# Altium schematic sheet DUT.SchDoc
size A1; SPICEModelCacheEPBFKGZM: <root> / <DocumentId>EPBFKGZM</DocumentId> / </root>
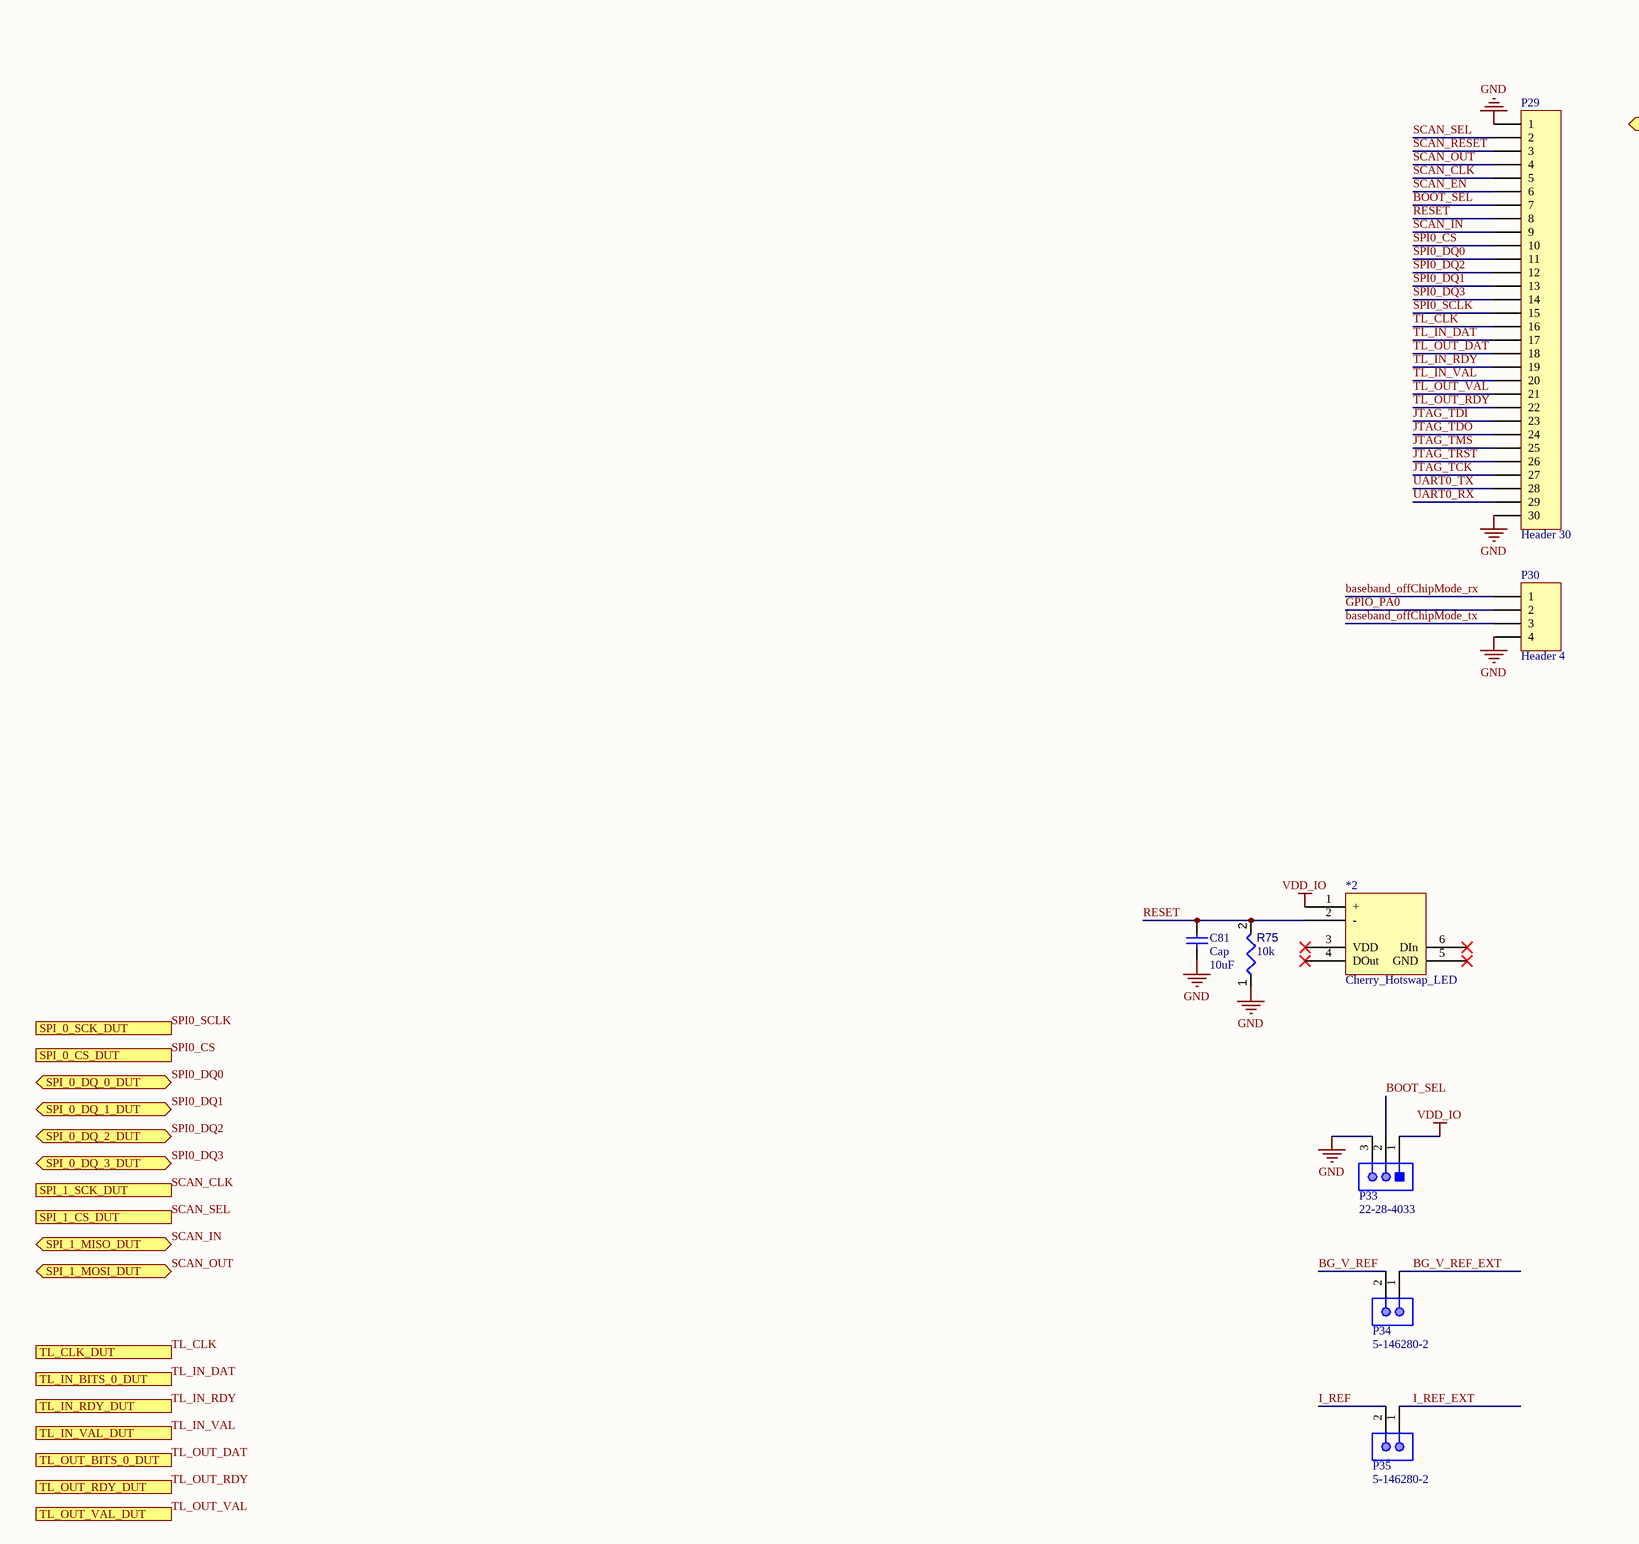
[diagram p0: DUT.SchDoc, top left]
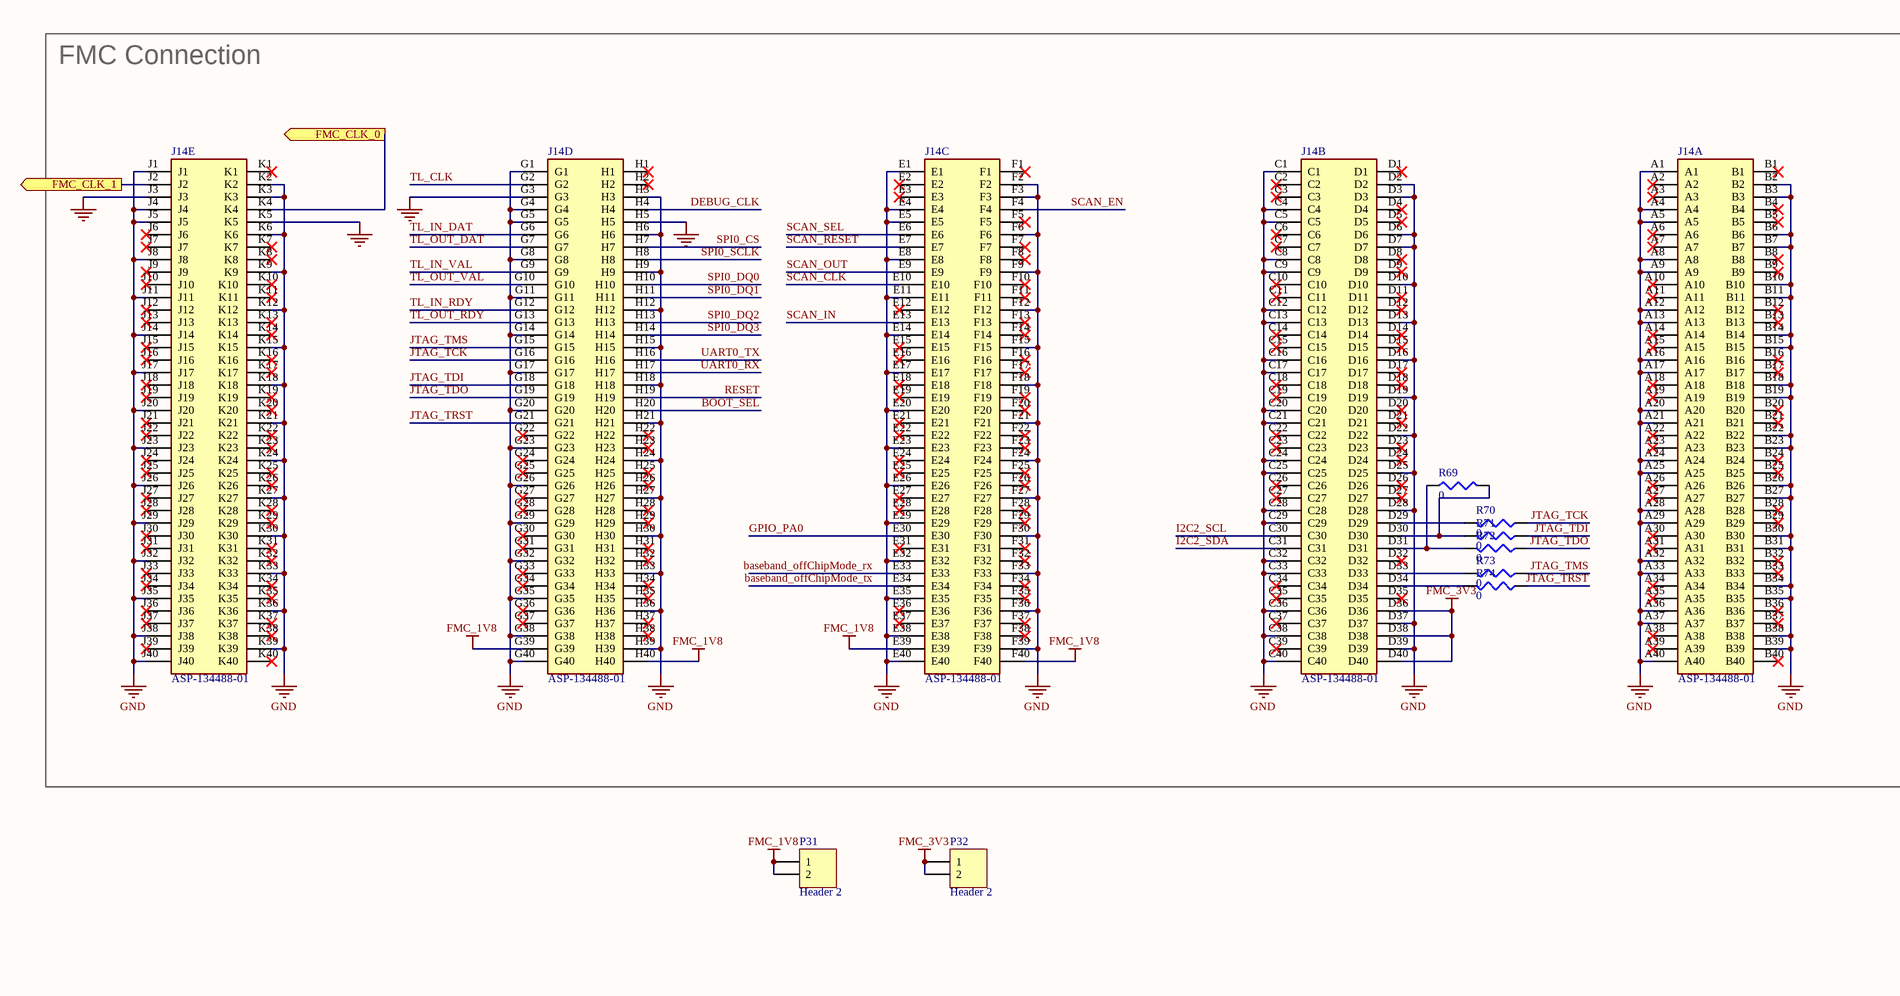
[diagram p1: DUT.SchDoc, top right]
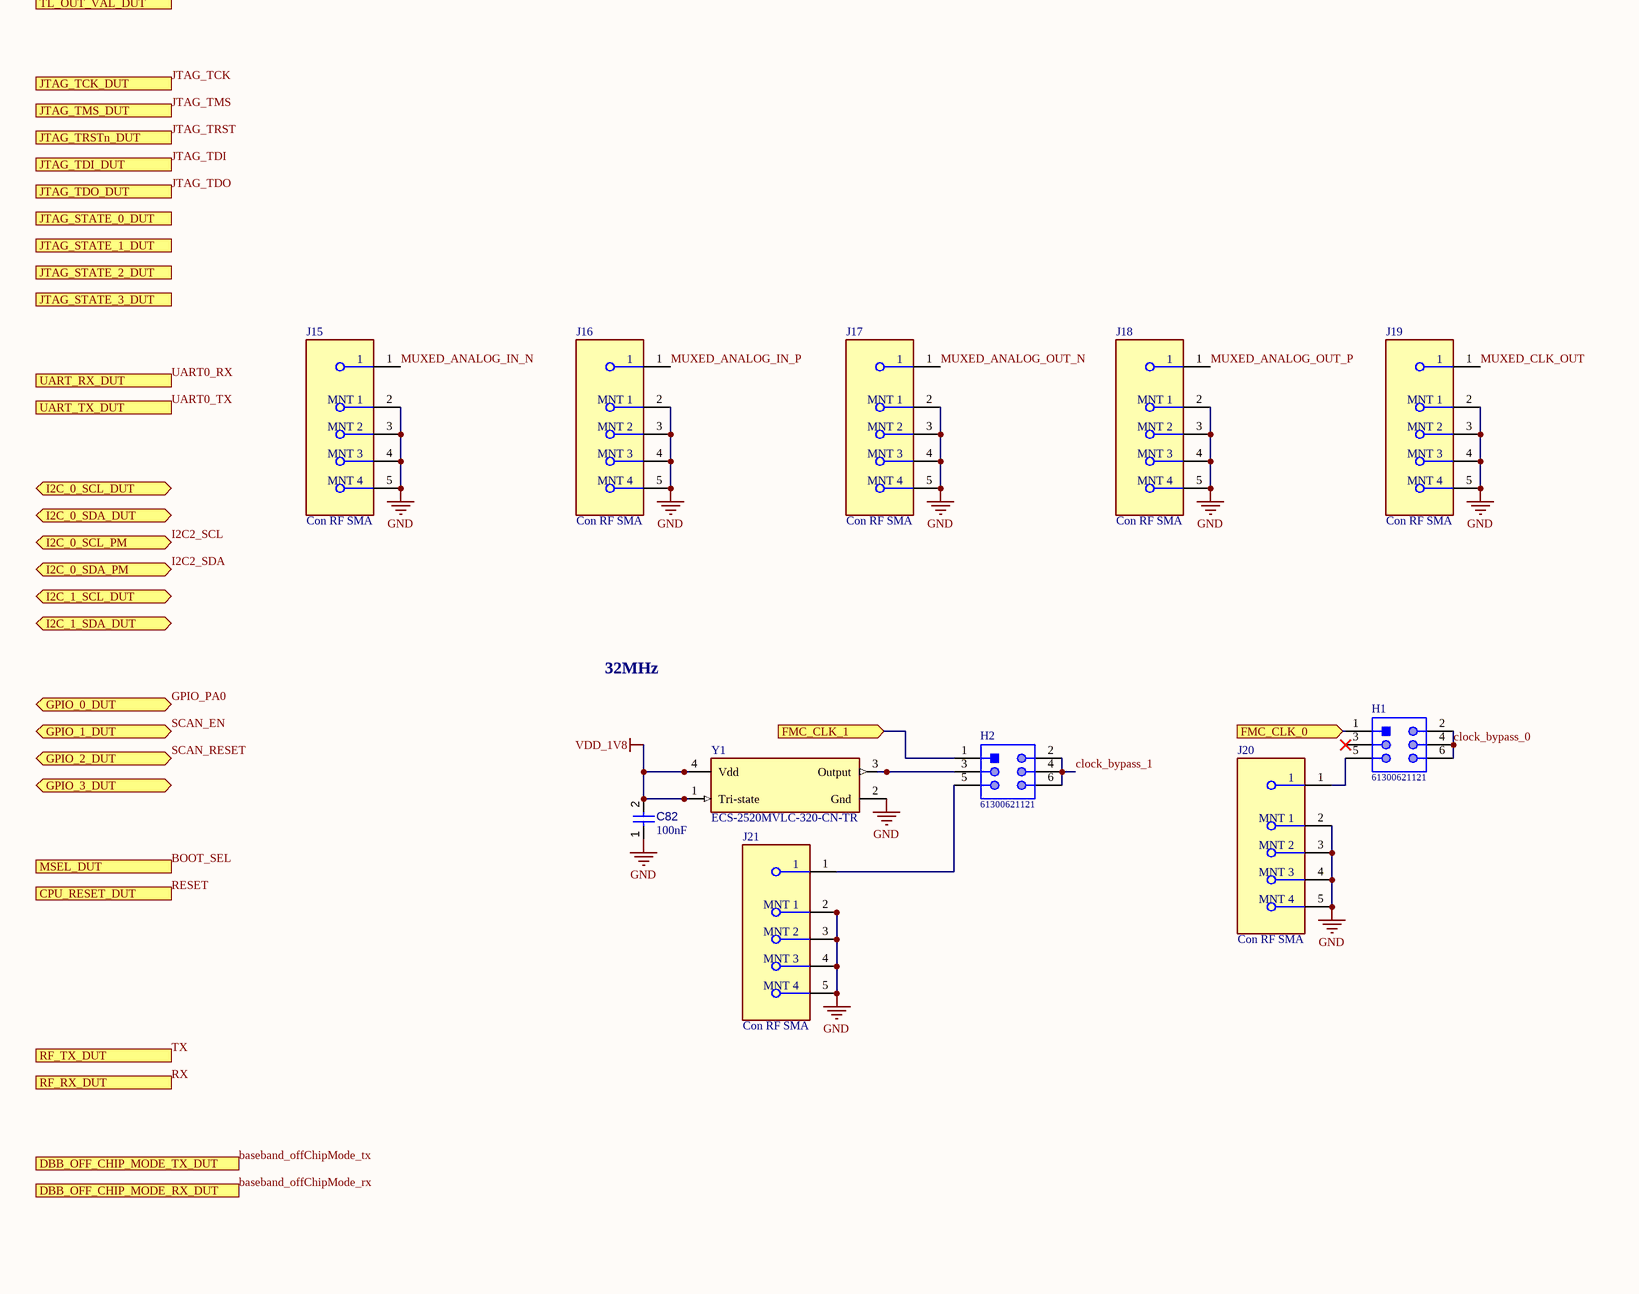
[diagram p2: DUT.SchDoc, bottom left]
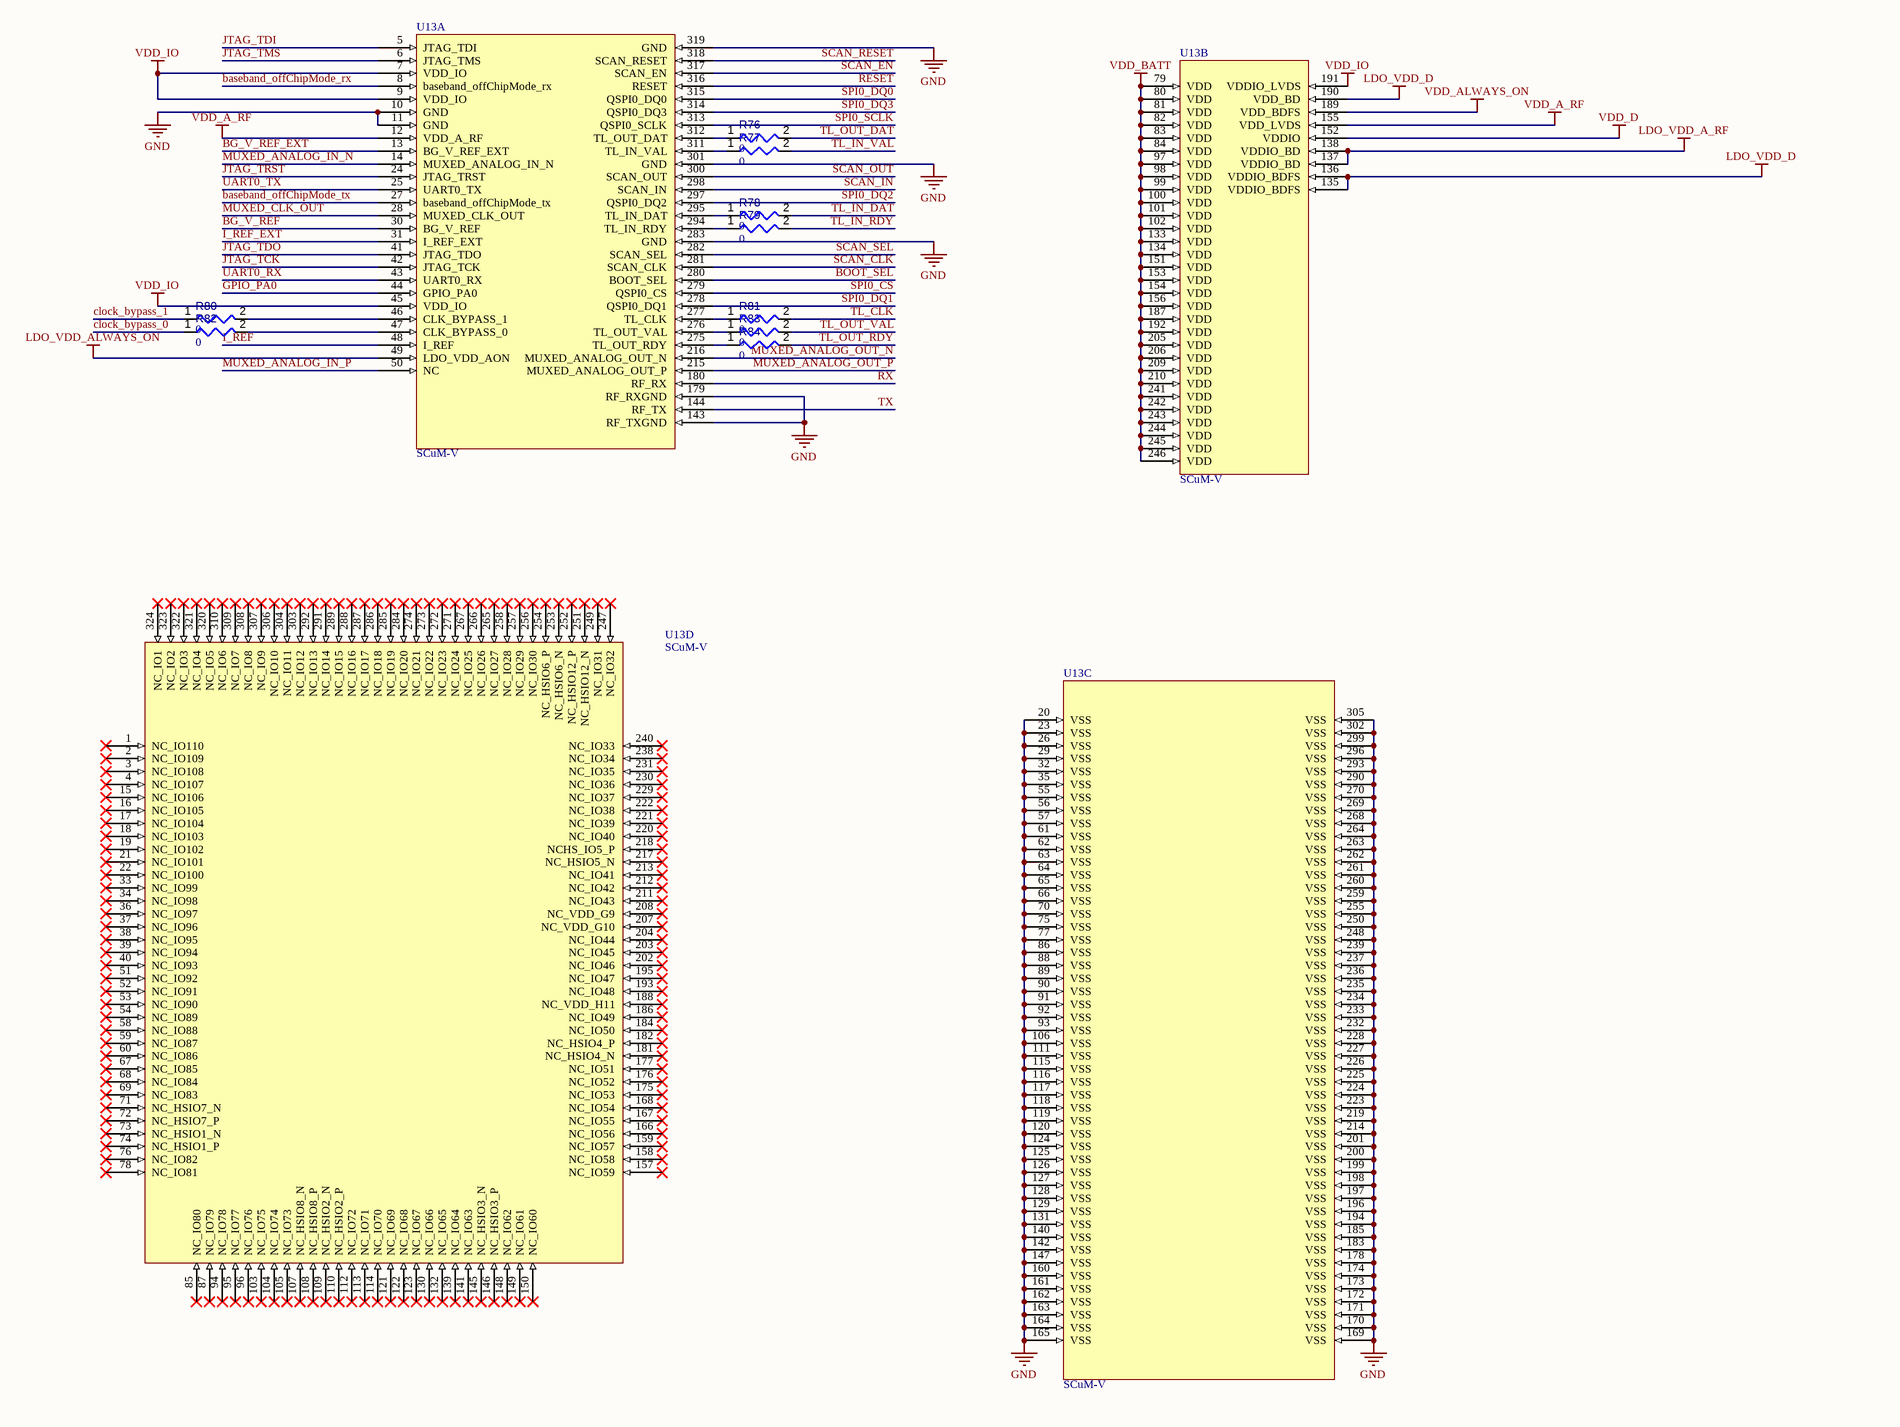
[diagram p3: DUT.SchDoc, bottom right]

## Parts
*2  Cherry_Hotswap_LED  [New footprint 1]
C81  Cap  value 10uF  [0805]
C82  value 100nF  [CAPC1608X90X40NL10T20]  (hidden comment: Capacitor 100 nF +/-10% 50 V 0603)
H1  61300621121  [61300621121]
H2  61300621121  [61300621121]
J14  ASP-134488-01  [SAMTEC_ASP-134488-01]  (parts A,B,C,D,E of 5)
J15  Con RF SMA  [FP-RF2-04A-T-00-50-G-MFG]
J16  Con RF SMA  [FP-RF2-04A-T-00-50-G-MFG]
J17  Con RF SMA  [FP-RF2-04A-T-00-50-G-MFG]
J18  Con RF SMA  [FP-RF2-04A-T-00-50-G-MFG]
J19  Con RF SMA  [FP-RF2-04A-T-00-50-G-MFG]
J20  Con RF SMA  [FP-RF2-04A-T-00-50-G-MFG]
J21  Con RF SMA  [FP-RF2-04A-T-00-50-G-MFG]
P29  Header 30  [HDR1X30]
P30  Header 4  [HDR1X4]
P31  Header 2  [HDR1X2]
P32  Header 2  [HDR1X2]
P33  22-28-4033  [MOLX-22-28-4033_V]
P34  5-146280-2  [TECO-5-146280-2_V]
P35  5-146280-2  [TECO-5-146280-2_V]
R69  0  [0603]
R70  0  [0603]
R71  0  [0603]
R72  0  [0603]
R73  0  [0603]
R74  0  [0603]
R75  value 10k  [RESC1608X55X25ML10T15]  (hidden comment: Resistor 10k +/-1% 0603 100 mW)
R76  value 0  [RESC0402(1005)_L]  (hidden comment: 0R2J)
R77  value 0  [RESC0402(1005)_L]  (hidden comment: 0R2J)
R78  value 0  [RESC0402(1005)_L]  (hidden comment: 0R2J)
R79  value 0  [RESC0402(1005)_L]  (hidden comment: 0R2J)
R80  value 0  [RESC0402(1005)_L]  (hidden comment: 0R2J)
R81  value 0  [RESC0402(1005)_L]  (hidden comment: 0R2J)
R82  value 0  [RESC0402(1005)_L]  (hidden comment: 0R2J)
R83  value 0  [RESC0402(1005)_L]  (hidden comment: 0R2J)
R84  value 0  [RESC0402(1005)_L]  (hidden comment: 0R2J)
U13  SCuM-V  [BGA324x18]  (parts A,B,C,D of 4)
Y1  ECS-2520MVLC-320-CN-TR  [FP-ECS-2520MVLC-MFG]

## Blocks framed on the sheet
FMC Connection: J14 R69-R74

## Ports
CPU_RESET_DUT (in), DBB_OFF_CHIP_MODE_RX_DUT (out), DBB_OFF_CHIP_MODE_TX_DUT (out), FMC_CLK_0 (in), FMC_CLK_0 (out), FMC_CLK_1 (in), FMC_CLK_1 (out), GPIO_0_DUT (bidir), GPIO_1_DUT (bidir), GPIO_2_DUT (bidir), GPIO_3_DUT (bidir), I2C_0_SCL_DUT (bidir), I2C_0_SCL_PM (bidir), I2C_0_SDA_DUT (bidir), I2C_0_SDA_PM (bidir), I2C_1_SCL_DUT (bidir), I2C_1_SDA_DUT (bidir), JTAG_STATE_0_DUT (out), JTAG_STATE_1_DUT (out), JTAG_STATE_2_DUT (out), JTAG_STATE_3_DUT (out), JTAG_TCK_DUT (in), JTAG_TDI_DUT (in), JTAG_TDO_DUT (out), JTAG_TMS_DUT (in), JTAG_TRSTn_DUT (in), MSEL_DUT (out), RF_RX_DUT (in), RF_TX_DUT (out), SPI_0_CS_DUT (out), SPI_0_DQ_0_DUT (bidir), SPI_0_DQ_1_DUT (bidir), SPI_0_DQ_2_DUT (bidir), SPI_0_DQ_3_DUT (bidir), SPI_0_SCK_DUT (out), SPI_1_CS_DUT (out), SPI_1_MISO_DUT (bidir), SPI_1_MOSI_DUT (bidir), SPI_1_SCK_DUT (out), TL_CLK_DUT (out), TL_IN_BITS_0_DUT (in), TL_IN_RDY_DUT (out), TL_IN_VAL_DUT (in), TL_OUT_BITS_0_DUT (out), TL_OUT_RDY_DUT (in), TL_OUT_VAL_DUT (out), UART_RX_DUT (in), UART_TX_DUT (out)

## Nets
FMC_1V8: J14.E39 J14.F40 J14.G39 J14.H40 P31.1 P31.2
FMC_3V3: J14.D36 J14.D38 J14.D40 P32.1 P32.2
GND: C81.1 C82.1 J14.A1 J14.A4 J14.A5 J14.A8 J14.A9 J14.A12 J14.A13 J14.A16 J14.A17 J14.A20 J14.A21 J14.A24 J14.A25 J14.A28 J14.A29 J14.A32 J14.A33 J14.A36 J14.A37 J14.A40 J14.B2 J14.B3 J14.B6 J14.B7 J14.B10 J14.B11 J14.B14 J14.B15 J14.B18 J14.B19 J14.B22 J14.B23 J14.B26 J14.B27 J14.B30 J14.B31 J14.B34 J14.B35 J14.B38 J14.B39 J14.C1 J14.C4 J14.C5 J14.C8 J14.C9 J14.C12 J14.C13 J14.C16 J14.C17 J14.C20 J14.C21 J14.C24 J14.C25 J14.C28 J14.C29 J14.C32 J14.C33 J14.C36 J14.C38 J14.C40 J14.D2 J14.D3 J14.D6 J14.D7 J14.D10 J14.D13 J14.D16 J14.D19 J14.D22 J14.D25 J14.D28 J14.D37 J14.D39 J14.E1 J14.E4 J14.E5 J14.E8 J14.E11 J14.E14 J14.E17 J14.E20 J14.E23 J14.E26 J14.E29 J14.E32 J14.E35 J14.E38 J14.E40 J14.F2 J14.F3 J14.F6 J14.F9 J14.F12 J14.F15 J14.F18 J14.F21 J14.F24 J14.F27 J14.F30 J14.F33 J14.F36 J14.F39 J14.G1 J14.G3 J14.G4 J14.G5 J14.G8 J14.G11 J14.G14 J14.G17 J14.G20 J14.G23 J14.G26 J14.G29 J14.G32 J14.G35 J14.G38 J14.G40 J14.H3 J14.H5 J14.H6 J14.H9 J14.H12 J14.H15 J14.H18 J14.H21 J14.H24 J14.H27 J14.H30 J14.H33 J14.H36 J14.H39 J14.J1 J14.J3 J14.J4 J14.J5 J14.J8 J14.J11 J14.J14 J14.J17 J14.J20 J14.J23 J14.J26 J14.J29 J14.J32 J14.J35 J14.J38 J14.J40 J14.K2 J14.K3 J14.K5 J14.K6 J14.K9 J14.K12 J14.K15 J14.K18 J14.K21 J14.K24 J14.K27 J14.K30 J14.K33 J14.K36 J14.K39 J15.2(MNT_1) J15.3(MNT_2) J15.4(MNT_3) J15.5(MNT_4) J16.2(MNT_1) J16.3(MNT_2) J16.4(MNT_3) J16.5(MNT_4) J17.2(MNT_1) J17.3(MNT_2) J17.4(MNT_3) J17.5(MNT_4) J18.2(MNT_1) J18.3(MNT_2) J18.4(MNT_3) J18.5(MNT_4) J19.2(MNT_1) J19.3(MNT_2) J19.4(MNT_3) J19.5(MNT_4) J20.2(MNT_1) J20.3(MNT_2) J20.4(MNT_3) J20.5(MNT_4) J21.2(MNT_1) J21.3(MNT_2) J21.4(MNT_3) J21.5(MNT_4) P29.1 P29.30 P30.4 P33.3 R75.1 U13.10(GND) U13.11(GND) U13.20(VSS) U13.23(VSS) U13.26(VSS) U13.29(VSS) U13.32(VSS) U13.35(VSS) U13.55(VSS) U13.56(VSS) U13.57(VSS) U13.61(VSS) U13.62(VSS) U13.63(VSS) U13.64(VSS) U13.65(VSS) U13.66(VSS) U13.70(VSS) U13.75(VSS) U13.77(VSS) U13.86(VSS) U13.88(VSS) U13.89(VSS) U13.90(VSS) U13.91(VSS) U13.92(VSS) U13.93(VSS) U13.106(VSS) U13.111(VSS) U13.115(VSS) U13.116(VSS) U13.117(VSS) U13.118(VSS) U13.119(VSS) U13.120(VSS) U13.124(VSS) U13.125(VSS) U13.126(VSS) U13.127(VSS) U13.128(VSS) U13.129(VSS) U13.131(VSS) U13.140(VSS) U13.142(VSS) U13.143(RF_TXGND) U13.147(VSS) U13.160(VSS) U13.161(VSS) U13.162(VSS) U13.163(VSS) U13.164(VSS) U13.165(VSS) U13.169(VSS) U13.170(VSS) U13.171(VSS) U13.172(VSS) U13.173(VSS) U13.174(VSS) U13.178(VSS) U13.179(RF_RXGND) U13.183(VSS) U13.185(VSS) U13.194(VSS) U13.196(VSS) U13.197(VSS) U13.198(VSS) U13.199(VSS) U13.200(VSS) U13.201(VSS) U13.214(VSS) U13.219(VSS) U13.223(VSS) U13.224(VSS) U13.225(VSS) U13.226(VSS) U13.227(VSS) U13.228(VSS) U13.232(VSS) U13.233(VSS) U13.234(VSS) U13.235(VSS) U13.236(VSS) U13.237(VSS) U13.239(VSS) U13.248(VSS) U13.250(VSS) U13.255(VSS) U13.259(VSS) U13.260(VSS) U13.261(VSS) U13.262(VSS) U13.263(VSS) U13.264(VSS) U13.268(VSS) U13.269(VSS) U13.270(VSS) U13.283(GND) U13.290(VSS) U13.293(VSS) U13.296(VSS) U13.299(VSS) U13.301(GND) U13.302(VSS) U13.305(VSS) U13.319(GND) Y1.2(Gnd)
LDO_VDD_A_RF: U13.137(VDDIO_BD) U13.138(VDDIO_BD)
LDO_VDD_ALWAYS_ON: U13.49(LDO_VDD_AON)
LDO_VDD_D: U13.135(VDDIO_BDFS) U13.136(VDDIO_BDFS) U13.190(VDD_BD)
VDD_1V8: C82.2 Y1.1(Tri-state) Y1.4(Vdd)
VDD_A_RF: U13.12(VDD_A_RF) U13.155(VDD_LVDS)
VDD_ALWAYS_ON: U13.189(VDD_BDFS)
VDD_BATT: U13.79(VDD) U13.80(VDD) U13.81(VDD) U13.82(VDD) U13.83(VDD) U13.84(VDD) U13.97(VDD) U13.98(VDD) U13.99(VDD) U13.100(VDD) U13.101(VDD) U13.102(VDD) U13.133(VDD) U13.134(VDD) U13.151(VDD) U13.153(VDD) U13.154(VDD) U13.156(VDD) U13.187(VDD) U13.192(VDD) U13.205(VDD) U13.206(VDD) U13.209(VDD) U13.210(VDD) U13.241(VDD) U13.242(VDD) U13.243(VDD) U13.244(VDD) U13.245(VDD) U13.246(VDD)
VDD_D: U13.152(VDDIO)
VDD_IO: *2.1(+) P33.1 U13.7(VDD_IO) U13.9(VDD_IO) U13.45(VDD_IO) U13.191(VDDIO_LVDS)
baseband_offChipMode_rx: J14.E33 P30.1 U13.8(baseband_offChipMode_rx) ; port DBB_OFF_CHIP_MODE_RX_DUT
baseband_offChipMode_tx: J14.E34 P30.3 U13.27(baseband_offChipMode_tx) ; port DBB_OFF_CHIP_MODE_TX_DUT
BG_V_REF: P34.2 U13.30(BG_V_REF)
BG_V_REF_EXT: P34.1 U13.13(BG_V_REF_EXT)
BOOT_SEL: J14.H20 P29.7 P33.2 U13.280(BOOT_SEL) ; port MSEL_DUT
clock_bypass_0: H1.2 H1.4 H1.6 R82.1
clock_bypass_1: H2.2 H2.4 H2.6 R80.1
DEBUG_CLK: J14.H4
FMC_CLK_0: H1.1 J14.K4 ; port FMC_CLK_0
FMC_CLK_1: H2.1 J14.J2 ; port FMC_CLK_1
GPIO_PA0: J14.E30 P30.2 U13.44(GPIO_PA0) ; port GPIO_0_DUT
I2C2_SCL: J14.C30 ; port I2C_0_SCL_PM
I2C2_SDA: J14.C31 ; port I2C_0_SDA_PM
I_REF: P35.2 U13.48(I_REF)
I_REF_EXT: P35.1 U13.31(I_REF_EXT)
JTAG_TCK: J14.G16 P29.27 R70.2 U13.42(JTAG_TCK) ; port JTAG_TCK_DUT
JTAG_TDI: J14.G18 P29.23 R71.2 U13.5(JTAG_TDI) ; port JTAG_TDI_DUT
JTAG_TDO: J14.G19 P29.24 R72.2 U13.41(JTAG_TDO) ; port JTAG_TDO_DUT
JTAG_TMS: J14.G15 P29.25 R73.2 U13.6(JTAG_TMS) ; port JTAG_TMS_DUT
JTAG_TRST: J14.G21 P29.26 R74.2 U13.24(JTAG_TRST) ; port JTAG_TRSTn_DUT
MUXED_ANALOG_IN_N: J15.1 U13.14(MUXED_ANALOG_IN_N)
MUXED_ANALOG_IN_P: J16.1 U13.50(NC)
MUXED_ANALOG_OUT_N: J17.1 U13.216(MUXED_ANALOG_OUT_N)
MUXED_ANALOG_OUT_P: J18.1 U13.215(MUXED_ANALOG_OUT_P)
MUXED_CLK_OUT: J19.1 U13.28(MUXED_CLK_OUT)
RESET: *2.2(-) C81.2 J14.H19 P29.8 R75.2 U13.316(RESET) ; port CPU_RESET_DUT
RX: U13.180(RF_RX) ; port RF_RX_DUT
SCAN_CLK: J14.E10 P29.5 U13.281(SCAN_CLK) ; port SPI_1_SCK_DUT
SCAN_EN: J14.F4 P29.6 U13.317(SCAN_EN) ; port GPIO_1_DUT
SCAN_IN: J14.E13 P29.9 U13.298(SCAN_IN) ; port SPI_1_MISO_DUT
SCAN_OUT: J14.E9 P29.4 U13.300(SCAN_OUT) ; port SPI_1_MOSI_DUT
SCAN_RESET: J14.E7 P29.3 U13.318(SCAN_RESET) ; port GPIO_2_DUT
SCAN_SEL: J14.E6 P29.2 U13.282(SCAN_SEL) ; port SPI_1_CS_DUT
SPI0_CS: J14.H7 P29.10 U13.279(QSPI0_CS) ; port SPI_0_CS_DUT
SPI0_DQ0: J14.H10 P29.11 U13.315(QSPI0_DQ0) ; port SPI_0_DQ_0_DUT
SPI0_DQ1: J14.H11 P29.13 U13.278(QSPI0_DQ1) ; port SPI_0_DQ_1_DUT
SPI0_DQ2: J14.H13 P29.12 U13.297(QSPI0_DQ2) ; port SPI_0_DQ_2_DUT
SPI0_DQ3: J14.H14 P29.14 U13.314(QSPI0_DQ3) ; port SPI_0_DQ_3_DUT
SPI0_SCLK: J14.H8 P29.15 U13.313(QSPI0_SCLK) ; port SPI_0_SCK_DUT
TL_CLK: J14.G2 P29.16 R81.2 ; port TL_CLK_DUT
TL_IN_DAT: J14.G6 P29.17 R78.2 ; port TL_IN_BITS_0_DUT
TL_IN_RDY: J14.G12 P29.19 R79.2 ; port TL_IN_RDY_DUT
TL_IN_VAL: J14.G9 P29.20 R77.2 ; port TL_IN_VAL_DUT
TL_OUT_DAT: J14.G7 P29.18 R76.2 ; port TL_OUT_BITS_0_DUT
TL_OUT_RDY: J14.G13 P29.22 R84.2 ; port TL_OUT_RDY_DUT
TL_OUT_VAL: J14.G10 P29.21 R83.2 ; port TL_OUT_VAL_DUT
TX: U13.144(RF_TX) ; port RF_TX_DUT
UART0_RX: J14.H17 P29.29 U13.43(UART0_RX) ; port UART_RX_DUT
UART0_TX: J14.H16 P29.28 U13.25(UART0_TX) ; port UART_TX_DUT
NetH1_5: H1.5 J20.1
NetH2_3: H2.3 Y1.3(Output)
NetH2_5: H2.5 J21.1
NetJ14_D29: J14.D29 R70.1
NetJ14_D30: J14.D30 R69.1 R71.1
NetJ14_D31: J14.D31 R69.2 R72.1
NetJ14_D33: J14.D33 R73.1
NetJ14_D34: J14.D34 R74.1
NetR76_1: R76.1 U13.312(TL_OUT_DAT)
NetR77_1: R77.1 U13.311(TL_IN_VAL)
NetR78_1: R78.1 U13.295(TL_IN_DAT)
NetR79_1: R79.1 U13.294(TL_IN_RDY)
NetR80_2: R80.2 U13.46(CLK_BYPASS_1)
NetR81_1: R81.1 U13.277(TL_CLK)
NetR82_2: R82.2 U13.47(CLK_BYPASS_0)
NetR83_1: R83.1 U13.276(TL_OUT_VAL)
NetR84_1: R84.1 U13.275(TL_OUT_RDY)

Not connected (* = marked no-connect by the designer): *2 3(VDD)* 4(DOut)* 5(GND)* 6(DIn)*; H1 3*; J14 A2* A3* A6* A7* A10* A11* A14* A15* A18* A19* A22* A23* A26* A27* A30* A31* A34* A35* A38* A39* B1* B4* B5* B8* B9* B12* B13* B16* B17* B20* B21* B24* B25* B28* B29* B32* B33* B36* B37* B40* C2* C3* C6* C7* C10* C11* C14* C15* C18* C19* C22* C23* C26* C27* C34* C35* C37* C39* D1* D4* D5* D8* D9* D11* D12* D14* D15* D17* D18* D20* D21* D23* D24* D26* D27* D32* D35* E2* E3* E12* E15* E16* E18* E19* E21* E22* E24* E25* E27* E28* E31* E36* E37* F1* F5* F7* F8* F10* F11* F13* F14* F16* F17* F19* F20* F22* F23* F25* F26* F28* F29* F31* F32* F34* F35* F37* F38* G22* G24* G25* G27* G28* G30* G31* G33* G34* G36* G37* H1* H2* H22* H23* H25* H26* H28* H29* H31* H32* H34* H35* H37* H38* J6* J7* J9* J10* J12* J13* J15* J16* J18* J19* J21* J22* J24* J25* J27* J28* J30* J31* J33* J34* J36* J37* J39* K1* K7* K8* K10* K11* K13* K14* K16* K17* K19* K20* K22* K23* K25* K26* K28* K29* K31* K32* K34* K35* K37* K38* K40*; U13 1(NC_IO110)* 2(NC_IO109)* 3(NC_IO108)* 4(NC_IO107)* 15(NC_IO106)* 16(NC_IO105)* 17(NC_IO104)* 18(NC_IO103)* 19(NC_IO102)* 21(NC_IO101)* 22(NC_IO100)* 33(NC_IO99)* 34(NC_IO98)* 36(NC_IO97)* 37(NC_IO96)* 38(NC_IO95)* 39(NC_IO94)* 40(NC_IO93)* 51(NC_IO92)* 52(NC_IO91)* 53(NC_IO90)* 54(NC_IO89)* 58(NC_IO88)* 59(NC_IO87)* 60(NC_IO86)* 67(NC_IO85)* 68(NC_IO84)* 69(NC_IO83)* 71(NC_HSIO7_N)* 72(NC_HSIO7_P)* 73(NC_HSIO1_N)* 74(NC_HSIO1_P)* 76(NC_IO82)* 78(NC_IO81)* 85(NC_IO80)* 87(NC_IO79)* 94(NC_IO78)* 95(NC_IO77)* 96(NC_IO76)* 103(NC_IO75)* 104(NC_IO74)* 105(NC_IO73)* 107(NC_HSIO8_N)* 108(NC_HSIO8_P)* 109(NC_HSIO2_N)* 110(NC_HSIO2_P)* 112(NC_IO72)* 113(NC_IO71)* 114(NC_IO70)* 121(NC_IO69)* 122(NC_IO68)* 123(NC_IO67)* 130(NC_IO66)* 132(NC_IO65)* 139(NC_IO64)* 141(NC_IO63)* 145(NC_HSIO3_N)* 146(NC_HSIO3_P)* 148(NC_IO62)* 149(NC_IO61)* 150(NC_IO60)* 157(NC_IO59)* 158(NC_IO58)* 159(NC_IO57)* 166(NC_IO56)* 167(NC_IO55)* 168(NC_IO54)* 175(NC_IO53)* 176(NC_IO52)* 177(NC_IO51)* 181(NC_HSIO4_N)* 182(NC_HSIO4_P)* 184(NC_IO50)* 186(NC_IO49)* 188(NC_VDD_H11)* 193(NC_IO48)* 195(NC_IO47)* 202(NC_IO46)* 203(NC_IO45)* 204(NC_IO44)* 207(NC_VDD_G10)* 208(NC_VDD_G9)* 211(NC_IO43)* 212(NC_IO42)* 213(NC_IO41)* 217(NC_HSIO5_N)* 218(NCHS_IO5_P)* 220(NC_IO40)* 221(NC_IO39)* 222(NC_IO38)* 229(NC_IO37)* 230(NC_IO36)* 231(NC_IO35)* 238(NC_IO34)* 240(NC_IO33)* 247(NC_IO32)* 249(NC_IO31)* 251(NC_HSIO12_N)* 252(NC_HSIO12_P)* 253(NC_HSIO6_N)* 254(NC_HSIO6_P)* 256(NC_IO30)* 257(NC_IO29)* 258(NC_IO28)* 265(NC_IO27)* 266(NC_IO26)* 267(NC_IO25)* 271(NC_IO24)* 272(NC_IO23)* 273(NC_IO22)* 274(NC_IO21)* 284(NC_IO20)* 285(NC_IO19)* 286(NC_IO18)* 287(NC_IO17)* 288(NC_IO16)* 289(NC_IO15)* 291(NC_IO14)* 292(NC_IO13)* 303(NC_IO12)* 304(NC_IO11)* 306(NC_IO10)* 307(NC_IO9)* 308(NC_IO8)* 309(NC_IO7)* 310(NC_IO6)* 320(NC_IO5)* 321(NC_IO4)* 322(NC_IO3)* 323(NC_IO2)* 324(NC_IO1)*

## Notes on the sheet
- 32MHz

## Library data of the parts
*2 = CMP-00028-00007-1
C81 = Cap: Capacitor; Published: 8-Jun-2000; LatestRevisionDate: 17-Jul-2002; LatestRevisionNote: Re-released for DXP Platform.; PackageReference: RAD-0.3; Publisher: Altium Limited; PackageDescription: Radial Cap, Thru-Hole; 2 Leads; 0.3 in Pin Spacing
C82 = CMP-001-00017-6: Chip Capacitor, 100 nF, +/- 10%, 50 V, 0603 (1608 Metric); Voltage Rating: 50V; Capacitor Type: Ceramic; Tolerance: 10%; Mounting Technology: SM; Max Operating Temperature: 125°C; RoHS Compliant: True; Pins: 2; Case/Package: 0603; Min Operating Temperature: -55°C
H1 H2 = CMP-1502-01072-1: THT Vertical Pin Header WR-PHD, Pitch 2.54 mm, Dual Row, 6 pins; Manufacturer: Wurth Elektronik; Contact Resistance: 20mOhm; Withstanding Voltage: 500VAC; Pin Number: 6; Gender: Male; Pitch: 2.54mm; Working Voltage: 250VAC; Rated Current: 3A; Packaging: Bag; Row Number: Dual; Manufacturer URL: http://www.we-online.de; Part Number: 61300621121; Operating Temperature: -40to105degC; Mounting Technology: THT; Package Reference: 61300621121; Datasheet URL: https://katalog.we-online.de/em/datasheet/6130xx21121.pdf; Orientation: Vertical; Publisher: WurthElektronik
J14 = CMP-013-000000-2: Board-To-Board Connector, Vita 57 XMC, ASP Series, Surface Mount, Header, 400, 1.27 mm; Source: ASP-134488-01.SchLib; MP: ASP-134488-01; Package: None; Component Type: Standard; Availability: Unavailable; Design Item ID: ASP-134488-01; Value: *; Price: None; Pin Count: 400
J15-J21 = CMP-42753-000002-1: CONN SMA JACK STR 50 OHM PCB
P29 = Header 30: Header, 30-Pin; LatestRevisionDate: 17-Jul-2002; LatestRevisionNote: Re-released for DXP Platform.; Publisher: Altium Limited
P30 = Header 4: Header, 4-Pin; LatestRevisionDate: 17-Jul-2002; LatestRevisionNote: Re-released for DXP Platform.; Publisher: Altium Limited
P31 P32 = Header 2: Header, 2-Pin; LatestRevisionDate: 17-Jul-2002; LatestRevisionNote: Re-released for DXP Platform.; Publisher: Altium Limited
P33 = CMP-1676-00001-5: Male Header, Pitch 2.54 mm, 1 x 3 Position, Height 8.38 mm, Tail Length 3.18 mm, RoHS, Bulk; Manufacturer: Molex; Rows: 1; Voltage Rating: 250 V; Current Rating: 4 A; Min Operating Temperature: 0 degC; Lead Pitch: 0.1 inch; Packaging: Bulk; Contact Finish: Gold; RoHSCompliant: true; Contact Material: Brass; PackageReference: 22-28-4033; REACH SVHC: Unknown; PackageDescription: Male Header, Pitch 2.54 mm, 1 x 3 Position, Height 8.38 mm, Tail Length 3.18 mm; ComponentLink2URL: http://www.molex.com/pdm_docs/sd/022284033_sd.pdf; Height: 8.38 mm; Mounting Technology: Through Hole; ComponentLink1Description: Manufacturer URL; Length: 7.62 mm; Mount: Through Hole; DatasheetVersion: Rev. G, 01/2012; Max Operating Temperature: 75 degC; ComponentLink2Description: Datasheet; Colour: Black; Pins: 3; Contact Plating: Gold; Package Quantity: 1; ComponentLink1URL: http://www.molex.com/
P34 P35 = CMP-2000-07492-1: Male Header, Pitch 2.54 mm, 1 x 2 Position, Height 8.21 mm, Tail Length 3.05 mm, -65 to 105 degC, RoHS, Bulk; Manufacturer: TE Connectivity; Mating Connector Lock: No(Without); Number of Positions: 2; Pitch: 2.54mm; PCB Mounting Orientation: Vertical; Keyed: No; Case\/Package: 100; Mating Post Length: 0.23inch; High Temperature Housing: Yes; Max Current Rating: 5A; PCB Thickness: 0.063inch; PCB Mount Retention: Without; Approvals: CSA; Current Rating: 3A; Radiation Hardening: No; Length: 4.67mm; Contact Mating Length: 0.23inch; Connector Type: Header; Number of Rows: 1; Termination Post Length: 0.12inch; Board Standoff: No(Without); Max Operating Temperature: 105degC; Contact Shape: Square; Selectively Loaded: No(Without); Gasket: No(Without); Number of Contacts: 2; Contact Gender: Male; Mating Alignment: No(Without); Manufacturer URL: http://www.te.com/; Datasheet URL: http://www.te.com/commerce/DocumentDelivery/DDEController?Action=showdoc&DocId=Customer+Drawing%7F146280%7FH1%7Fpdf%7FEnglish%7FENG_CD_146280_H1.pdf%7F5-146280-2; Mount: ThroughHole; Orientation: Straight; Packaging: Carton; Package Reference: 5-146280-2; Package Quantity: 500; Stabilizers: No(Without); Row Spacing: 2.54mm; Contact Material: CopperAlloy; Panel Mount Retention: No(Without); Datasheet Version: Rev. H1, 08/2016; Housing Colour: Black; Colour: Black; Package Description: Male Header, Pitch 2.54 mm, 1 x 2 Position, Height 8.21 mm, Tail Length 3.05 mm; Contact Plating: Matte; Housing Material: Polymer; Contact Protection: No(Without); Min Operating Temperature: -65degC; Mounting Technology: ThroughHole; Flammability Rating: UL94V-0; RoHSCompliant: true; Termination: ThroughHole; Depth: 2.34mm; High Speed Serial Data Connector: No
R69-R74 = DISCRETE_R: 0 0603
R75 = CMP-009-00017-5: Chip Resistor, 10 KOhm, +/- 1%, 01 W, -55 to 155 degC, 0603 (1608 Metric); Voltage Rating: 50V; Power: 100mW; RoHS Compliant: True; Min Operating Temperature: -55°C; Pins: 2; Case/Package: 0603; Mounting Technology: SM; Max Operating Temperature: 155°C; Tolerance: 1%
R76-R84 = CMP-009-00062-2: Jumper 0402 (1005 Metric); Pins: 2; Mounting Technology: SMT; Case/Package: 0402
U13 = SCuM-V-2: SCuM-V chip from Sp22 Tapeout class
Y1 = CMP-40224-000047-1: XTAL OSC XO 16MHZ CMOS SMD